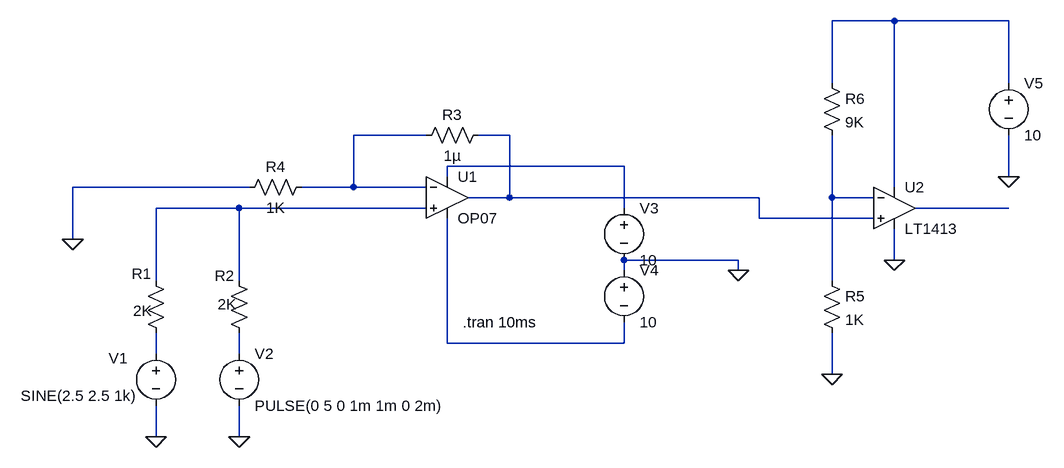
[diagram p0: schematic spice3d.asc]
spice3d.asc, the LTspice schematic file:
Version 4
SHEET 1 1428 680
WIRE 896 -160 800 -160
WIRE 1072 -160 896 -160
WIRE 800 -64 800 -160
WIRE 1072 -64 1072 -160
WIRE 176 16 64 16
WIRE 304 16 256 16
WIRE 480 64 208 64
WIRE 208 80 208 64
WIRE 1072 80 1072 16
WIRE -96 96 -368 96
WIRE 64 96 64 16
WIRE 64 96 -16 96
WIRE 176 96 64 96
WIRE 896 96 896 -160
WIRE 304 112 304 16
WIRE 304 112 240 112
WIRE 688 112 304 112
WIRE 800 112 800 16
WIRE 864 112 800 112
WIRE -112 128 -240 128
WIRE 176 128 -112 128
WIRE 480 128 480 64
WIRE 1072 128 928 128
WIRE 688 144 688 112
WIRE 864 144 688 144
WIRE -368 176 -368 96
WIRE 656 208 480 208
WIRE 896 208 896 160
WIRE 480 224 480 208
WIRE 656 224 656 208
WIRE -240 240 -240 128
WIRE -112 240 -112 128
WIRE 800 240 800 112
WIRE 208 336 208 144
WIRE 480 336 480 304
WIRE 480 336 208 336
WIRE -240 352 -240 320
WIRE -112 352 -112 320
WIRE 800 384 800 320
WIRE -240 480 -240 432
WIRE -112 480 -112 432
FLAG -240 480 0
FLAG -112 480 0
FLAG 656 224 0
FLAG 896 208 0
FLAG 1072 80 0
FLAG 800 384 0
FLAG -368 176 0
SYMBOL OpAmps\\OP07 208 48 R0
SYMATTR InstName U1
SYMBOL res -256 224 R0
WINDOW 0 -21 5 Left 2
WINDOW 3 -19 62 Left 2
SYMATTR InstName R1
SYMATTR Value 2K
SYMBOL res -128 224 R0
WINDOW 0 -22 8 Left 2
WINDOW 3 -17 52 Left 2
SYMATTR InstName R2
SYMATTR Value 2K
SYMBOL voltage -240 336 R0
WINDOW 3 -208 81 Left 2
WINDOW 123 0 0 Left 0
WINDOW 39 0 0 Left 0
WINDOW 0 -73 23 Left 2
SYMATTR Value SINE(2.5 2.5 1k)
SYMATTR InstName V1
SYMBOL voltage -112 336 R0
WINDOW 123 0 0 Left 0
WINDOW 39 0 0 Left 0
SYMATTR InstName V2
SYMATTR Value PULSE(0 5 0 1m 1m 0 2m)
SYMBOL res 160 32 R270
WINDOW 0 32 56 VTop 2
WINDOW 3 0 56 VBottom 2
SYMATTR InstName R3
SYMATTR Value 1µ
SYMBOL voltage 480 112 R0
WINDOW 123 0 0 Left 0
WINDOW 39 0 0 Left 0
SYMATTR InstName V3
SYMATTR Value 10
SYMBOL voltage 480 208 R0
WINDOW 123 0 0 Left 0
WINDOW 39 0 0 Left 0
SYMATTR InstName V4
SYMATTR Value 10
SYMBOL OpAmps\\LT1413 896 64 R0
SYMATTR InstName U2
SYMBOL res 784 224 R0
SYMATTR InstName R5
SYMATTR Value 1K
SYMBOL res 784 -80 R0
SYMATTR InstName R6
SYMATTR Value 9K
SYMBOL voltage 1072 -80 R0
WINDOW 123 0 0 Left 0
WINDOW 39 0 0 Left 0
SYMATTR InstName V5
SYMATTR Value 10
SYMBOL res 0 80 R90
WINDOW 0 0 56 VBottom 2
WINDOW 3 32 56 VTop 2
SYMATTR InstName R4
SYMATTR Value 1K
TEXT 232 304 Left 2 !.tran 10ms

The netlist it stands for:
* spice3d.asc
XU1 N006 N002 N004 N008 N003 LT1001  ; OP07, pins In+ In- V+ V- OUT
R1 N006 N009 2K
R2 N006 N010 2K
V1 N009 0 SINE(2.5 2.5 1k)
V2 N010 0 PULSE(0 5 0 1m 1m 0 2m)
R3 N002 N003 1µ
V3 N004 0 10
V4 0 N008 10
XU2 N003 N005 N001 0 N007 LT1413  ; pins In+ In- V+ V- OUT
R5 N005 0 1K
R6 N001 N005 9K
V5 N001 0 10
R4 N002 0 1K
.tran 10ms
.lib LTC.lib
.backanno
.end